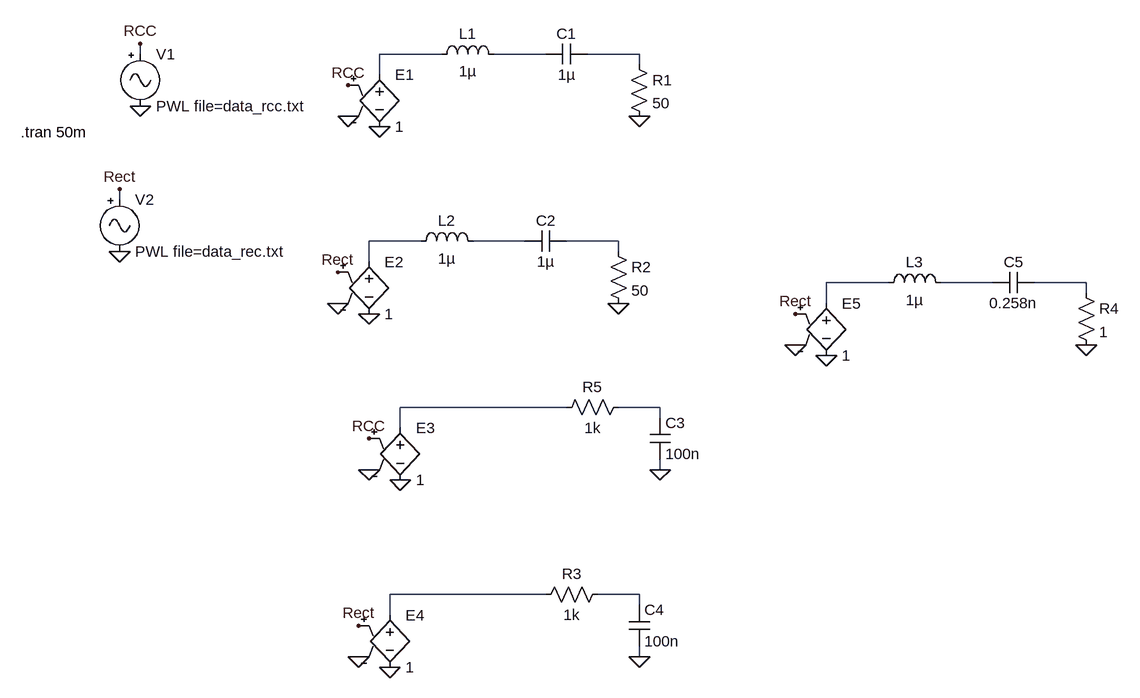
[diagram p0: schematic rlcsim.asc]
rlcsim.asc, the LTspice schematic file:
Version 4
SHEET 1 884 1332
WIRE -640 32 -640 16
WIRE -176 32 -272 32
WIRE -16 32 -96 32
WIRE 128 32 48 32
WIRE 128 48 128 32
WIRE -272 64 -272 32
WIRE -672 256 -672 240
WIRE -208 320 -288 320
WIRE -48 320 -128 320
WIRE 96 320 16 320
WIRE 96 336 96 320
WIRE -288 352 -288 320
WIRE 512 384 416 384
WIRE 672 384 592 384
WIRE 816 384 736 384
WIRE 816 400 816 384
WIRE 416 416 416 384
WIRE 16 576 -240 576
WIRE 160 576 96 576
WIRE 160 592 160 576
WIRE -240 608 -240 576
WIRE 160 672 160 656
WIRE -16 864 -256 864
WIRE 128 864 64 864
WIRE 128 880 128 864
WIRE -256 896 -256 864
WIRE 128 960 128 944
FLAG 128 128 0
FLAG -640 112 0
FLAG 96 416 0
FLAG -672 336 0
FLAG -672 240 Rect
FLAG -640 16 RCC
FLAG -272 144 0
FLAG -288 432 0
FLAG -336 416 0
FLAG -320 128 0
FLAG -320 80 RCC
FLAG -336 368 Rect
FLAG 160 672 0
FLAG 128 960 0
FLAG -240 688 0
FLAG -256 976 0
FLAG -304 960 0
FLAG -288 672 0
FLAG -288 624 RCC
FLAG -304 912 Rect
FLAG 816 480 0
FLAG 416 496 0
FLAG 368 480 0
FLAG 368 432 Rect
SYMBOL res 112 32 R0
SYMATTR InstName R1
SYMATTR Value 50
SYMBOL cap 48 16 R90
WINDOW 0 0 32 VBottom 2
WINDOW 3 32 32 VTop 2
SYMATTR InstName C1
SYMATTR Value 1µ
SYMBOL ind -192 48 R270
WINDOW 0 32 56 VTop 2
WINDOW 3 5 56 VBottom 2
SYMATTR InstName L1
SYMATTR Value 1µ
SYMBOL Misc\\signal -640 16 R0
WINDOW 123 0 0 Left 0
WINDOW 39 0 0 Left 0
SYMATTR InstName V1
SYMATTR Value PWL file=data_rcc.txt
SYMBOL res 80 320 R0
SYMATTR InstName R2
SYMATTR Value 50
SYMBOL cap 16 304 R90
WINDOW 0 0 32 VBottom 2
WINDOW 3 32 32 VTop 2
SYMATTR InstName C2
SYMATTR Value 1µ
SYMBOL ind -224 336 R270
WINDOW 0 32 56 VTop 2
WINDOW 3 5 56 VBottom 2
SYMATTR InstName L2
SYMATTR Value 1µ
SYMBOL Misc\\signal -672 240 R0
WINDOW 123 0 0 Left 0
WINDOW 39 0 0 Left 0
SYMATTR InstName V2
SYMATTR Value PWL file=data_rec.txt
SYMBOL e -272 48 R0
SYMATTR InstName E1
SYMATTR Value 1
SYMBOL e -288 336 R0
SYMATTR InstName E2
SYMATTR Value 1
SYMBOL e -240 592 R0
SYMATTR InstName E3
SYMATTR Value 1
SYMBOL e -256 880 R0
SYMATTR InstName E4
SYMATTR Value 1
SYMBOL res 112 560 R90
WINDOW 0 0 56 VBottom 2
WINDOW 3 32 56 VTop 2
SYMATTR InstName R5
SYMATTR Value 1k
SYMBOL res 80 848 R90
WINDOW 0 0 56 VBottom 2
WINDOW 3 32 56 VTop 2
SYMATTR InstName R3
SYMATTR Value 1k
SYMBOL cap 144 592 R0
SYMATTR InstName C3
SYMATTR Value 100n
SYMBOL cap 112 880 R0
SYMATTR InstName C4
SYMATTR Value 100n
SYMBOL res 800 384 R0
SYMATTR InstName R4
SYMATTR Value 1
SYMBOL cap 736 368 R90
WINDOW 0 0 32 VBottom 2
WINDOW 3 32 32 VTop 2
SYMATTR InstName C5
SYMATTR Value 0.258n
SYMBOL ind 496 400 R270
WINDOW 0 32 56 VTop 2
WINDOW 3 5 56 VBottom 2
SYMATTR InstName L3
SYMATTR Value 1µ
SYMBOL e 416 400 R0
SYMATTR InstName E5
SYMATTR Value 1
TEXT -824 152 Left 2 !.tran 50m

The netlist it stands for:
* rlcsim.asc
R1 N003 0 50
C1 N003 N002 1µ
L1 N001 N002 1µ
V1 RCC 0 PWL file=data_rcc.txt
R2 N006 0 50
C2 N006 N005 1µ
L2 N004 N005 1µ
V2 Rect 0 PWL file=data_rec.txt
E1 N001 0 RCC 0 1
E2 N004 0 Rect 0 1
E3 N010 0 RCC 0 1
E4 N012 0 Rect 0 1
R5 N011 N010 1k
R3 N013 N012 1k
C3 N011 0 100n
C4 N013 0 100n
R4 N009 0 1
C5 N009 N008 0.258n
L3 N007 N008 1µ
E5 N007 0 Rect 0 1
.tran 50m
.backanno
.end